# EAGLE design v1.0 SMT Practice Keychain (EAGLE 9.6.2)
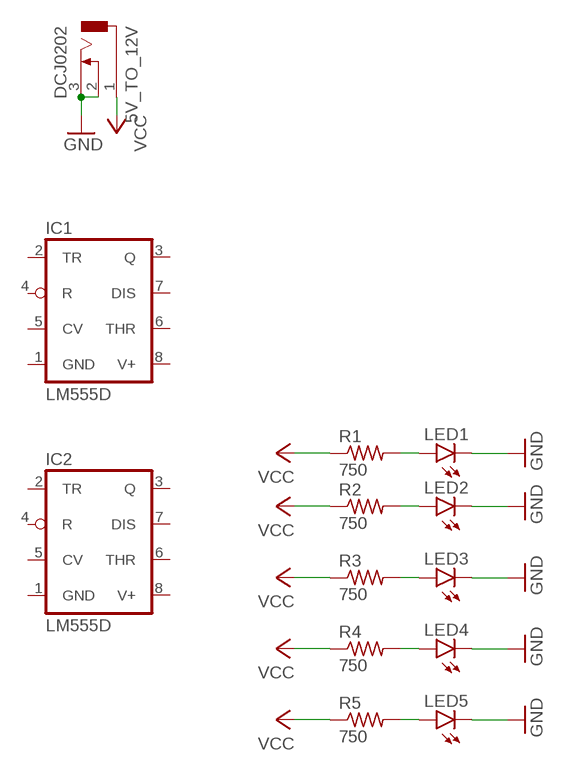
[diagram p0: schematic, sheet 1]

## Parts
5V_TO_12V  DCJ0202  [DCJ0202]
IC1  LM555D  [SO08]
IC2  LM555D  [SO08]
LED1  LEDCHIPLED_1206  [CHIPLED_1206]
LED2  LEDCHIPLED_1206  [CHIPLED_1206]
LED3  LEDCHIPLED_1206  [CHIPLED_1206]
LED4  LEDCHIPLED_1206  [CHIPLED_1206]
LED5  LEDCHIPLED_1206  [CHIPLED_1206]
R1  750  R-US_R1206  [R1206]
R2  750  R-US_R1206  [R1206]
R3  750  R-US_R1206  [R1206]
R4  750  R-US_R1206  [R1206]
R5  750  R-US_R1206  [R1206]

## Nets
GND: 5V_TO_12V.2 5V_TO_12V.3 LED1.C LED2.C LED3.C LED4.C LED5.C
N$1: LED1.A R1.2
N$2: LED2.A R2.2
N$3: LED3.A R3.2
N$4: LED4.A R4.2
N$5: LED5.A R5.2
VCC: 5V_TO_12V.1 R1.1 R2.1 R3.1 R4.1 R5.1
Unconnected: IC1.2(TR) IC1.3(Q) IC1.4(R) IC1.5(CV) IC1.6(THR) IC1.7(DIS) IC2.2(TR) IC2.3(Q) IC2.4(R) IC2.5(CV) IC2.6(THR) IC2.7(DIS)

## Power pins joined to a net without a drawn wire
GND: IC1.1(GND) IC2.1(GND)
V+: IC1.8(V+) IC2.8(V+)

## Library data of the parts
5V_TO_12V = con-jack:DCJ0202: DC POWER JACK Source: DCJ0202.pdf; OC_FARNELL: unknown; OC_NEWARK: unknown
IC1 IC2 = adafruit:*555: TIMER Changed DIP package to have round (not oval) pin pads http://www.ladyada.net/library/pcb/eaglelibrary.html
LED1-LED5 = led:LED: LED OSRAM: - CHIPLED LG R971, LG N971, LY N971, LG Q971, LY Q971, LO R971, LY R971 LH N974, LH R974 LS Q976, LO Q976, LY Q976 LO Q996 - Hyper CHIPLED LW Q18S LB Q993, LB Q99A, LB R99A - SideLED LS A670, LO A670, LY A670, LG A670, LP A670 LB A673, LV A673, LT A673, LW A673 LH A674 LY A675 LS A676, LA A676, LO A676, LY A676, LW A676 LS A679, LY A679, LG A679 - Hyper Micro SIDELED® LS Y876, LA Y876, LO Y876, LY Y876 LT Y87S - SmartLED LW L88C, LW L88S LB L89C, LB L89S, LG L890 LS L89K, LO L89K, LY L89K LS L896, LA L896, LO L896, LY L896 - TOPLED LS T670, LO T670, LY T670, LG T670, LP T670 LSG T670, LSP T670, LSY T670, LOP T670, LYG T670 LG T671, LOG T671, LSG T671 LB T673, LV T673, LT T673, LW T673 LH T674 LS T676, LA T676, LO T676, LY T676, LB T676, LH T676, LSB T676, LW T676 LB T67C, LV T67C, LT T67C, LS T67K, LO T67K, LY T67K, LW E67C LS E67B, LA E67B, LO E67B, LY E67B, LB E67C, LV E67C, LT E67C LW T67C LS T679, LY T679, LG T679 LS T770, LO T770, LY T770, LG T770, LP T770 LB T773, LV T773, LT T773, LW T773 LH T774 LS E675, LA E675, LY E675, LS T675 LS T776, LA T776, LO T776, LY T776, LB T776 LHGB T686 LT T68C, LB T68C - Hyper Mini TOPLED® LB M676 - Mini TOPLED Santana® LG M470 LS M47K, LO M47K, LY M47K Source: http://www.osram.convergy.de LUXEON: - LUMILED® LXK2-PW12-R00, LXK2-PW12-S00, LXK2-PW14-U00, LXK2-PW14-V00 LXK2-PM12-R00, LXK2-PM12-S00, LXK2-PM14-U00 LXK2-PE12-Q00, LXK2-PE12-R00, LXK2-PE12-S00, LXK2-PE14-T00, LXK2-PE14-U00 LXK2-PB12-K00, LXK2-PB12-L00, LXK2-PB12-M00, LXK2-PB14-N00, LXK2-PB14-P00, LXK2-PB14-Q00 LXK2-PR12-L00, LXK2-PR12-M00, LXK2-PR14-Q00, LXK2-PR14-R00 LXK2-PD12-Q00, LXK2-PD12-R00, LXK2-PD12-S00 LXK2-PH12-R00, LXK2-PH12-S00 LXK2-PL12-P00, LXK2-PL12-Q00, LXK2-PL12-R00 Source: www.luxeon.com KINGBRIGHT: KA-3528ASYC Source: www.kingbright.com
R1-R5 = adafruit:R-US_: RESISTOR, American symbol

## Board
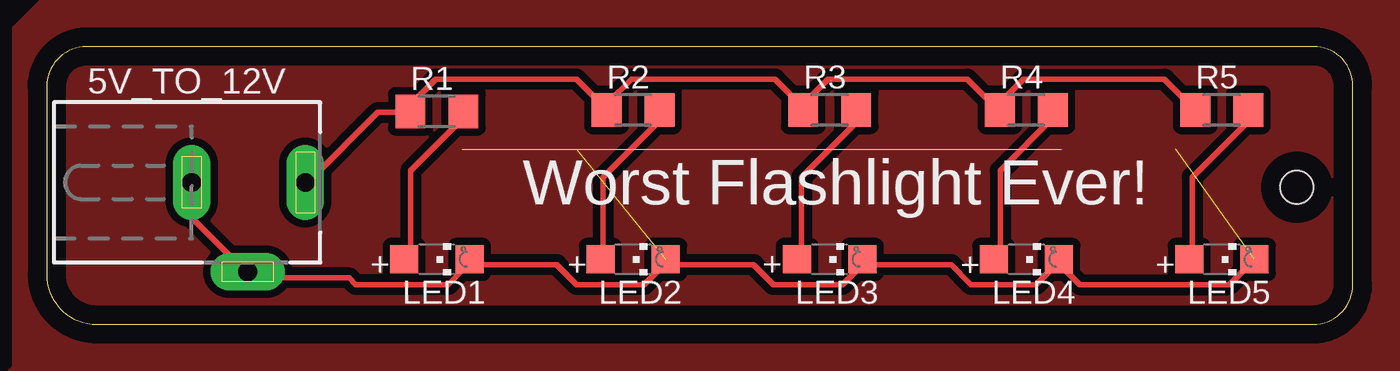
[diagram p1: board, top side]
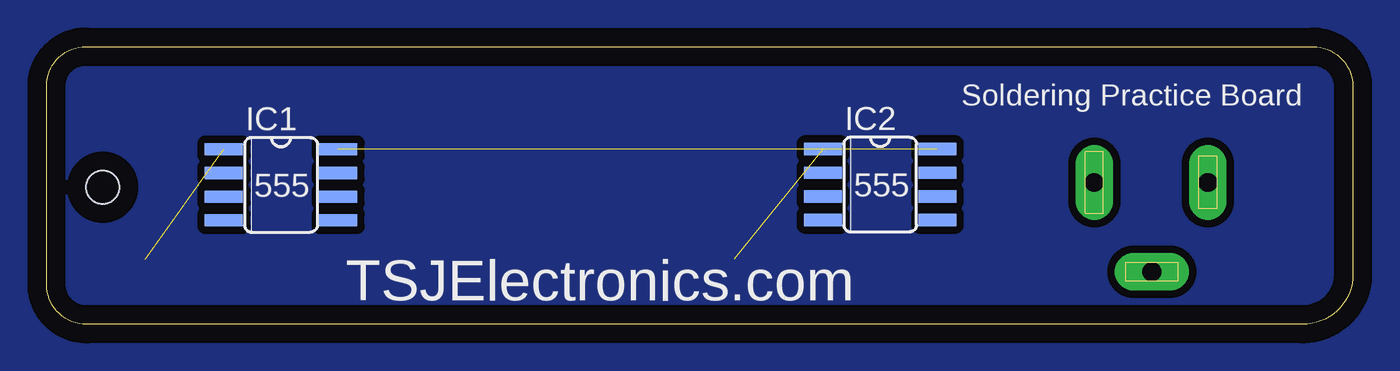
[diagram p2: board, bottom side, seen from below]

Size 70.15 x 14.91 mm. Coordinates in mm from the lower left corner, seen from the top.
Outline: 70.15,2.13 70.15,12.8 arc90 68.03,14.91 2.15,14.91 arc90 0,12.76 0,2.69 arc90 2.69,0 68.01,0 arc90 70.15,2.13
Copper layers (1*16): Top 0.035mm / dielectric 1.5mm / Bottom 0.035mm
Design rules "default *": minimum track width 12mil, minimum drill 0.35mm, track to track 16mil, track to pad 16mil, pad to pad 16mil, via to via 16mil, smd to smd 16mil, copper to edge 40mil, drill to drill 6mil, minimum pad ring 10mil, minimum via ring 8mil, stop-mask expansion 4mil, vias tented up to drill 0mil, thermal gap 10mil
Holes 1.78 mm at 67.14,7.36

### Footprints (pad centres in the part's own frame; a part is rotated, then mirrored left to right if it is on the bottom)
DCJ0202 = drill 1 pad 2 long: 1 0,3.1; 2 4.8,0; 3 0,-3
SO08 = smd 0.66 x 2.032: 1 -1.905,-3.073; 2 -0.635,-3.073; 3 0.635,-3.073; 4 1.905,-3.073; 5 1.905,3.073; 6 0.635,3.073; 7 -0.635,3.073; 8 -1.905,3.073
CHIPLED_1206 = smd 1.5 x 1.5: A 0,-1.75; C 0,1.75
R1206 = smd 1.6 x 1.803: 1 -1.422,0; 2 1.422,0

### Placement (x,y rotation side)
5V_TO_12V  10.79,7.62 270 top
IC1  57.56,7.49 270 bottom
IC2  25.39,7.5 270 bottom
LED1  20.95,3.49 270 top
LED2  31.49,3.49 270 top
LED3  42.05,3.49 270 top
LED4  52.61,3.49 270 top
LED5  63.1,3.49 270 top
R1  20.95,11.43 0 top
R2  31.49,11.51 0 top
R3  42.06,11.51 0 top
R4  52.61,11.51 0 top
R5  63.1,11.51 0 top

### Tracks (layer width: path | path; a pad name or v marks a point on that pad's centre or on a via)
BB
  pour Top: -1.8,15.93 -1.8,-2.27 -2.11,-2.58 73.89,-2.58 74.75,-1.72 72.79,0.23 72.79,19.76 2.03,19.76
BBB
  pour Bottom: -3.36,20.23 -3.36,-5.47 -2.66,-6.17 76.93,-6.17 79.28,-3.83 79.28,19.99 76.62,22.65 -0.94,22.65
GND  (2 unrouted)
  Top 0.305: 5V_TO_12V.3 7.82,7.47 7.82,5.69 10.67,2.85 5V_TO_12V.2 11.02,2.49 16.25,2.49 16.6,2.13 21.56,2.13 22.4,2.97 22.4,3.2 LED1.C 22.76,3.2 27.39,3.2 28.46,2.13 32.09,2.13 32.96,3 LED2.C 33.43,3.2 37.96,3.2 39.03,2.13 42.73,2.13 43.72,3.13 LED3.C 44.09,3.2 48.58,3.2 49.65,2.13 53.13,2.13 54.36,3.37 LED4.C 54.41,3.2 55.47,2.13 63.51,2.13 64.58,3.2 64.36,3.2 LED5.C 64.72,3.2
N$1
  Top 0.305: R1.2 22.38,11.07 19.56,8.26 19.56,3.56 LED1.A
N$2
  Top 0.305: R2.2 32.91,10.94 29.87,7.9 29.87,3.56 LED2.A
N$3
  Top 0.305: LED3.A 40.54,3.56 40.54,7.9 43.48,10.84 R3.2
N$4
  Top 0.305: R4.2 54.03,11.08 51.21,8.26 51.21,3.56 LED4.A
N$5
  Top 0.305: R5.2 64.53,10.91 61.52,7.9 61.52,3.56 LED5.A
V+  (1 unrouted)
VCC
  Top 0.305: 5V_TO_12V.1 14.22,7.82 17.78,11.38 19.2,11.38 R1.1 19.57,11.85 20.88,13.16 28.45,13.16 29.87,11.73 R2.1 30.07,11.78 30.16,11.91 31.41,13.16 39.12,13.16 40.54,11.73 R3.1 40.63,11.83 41.96,13.16 49.44,13.16 50.89,11.71 R4.1 51.22,11.91 52.46,13.16 60.03,13.16 61.45,11.73 61.52,11.73 R5.1

### Text on the board
tPlace: Worst Flashlight Ever! | + | + | + | + | +
bPlace: Soldering Practice Board | 555 | 555 | TSJElectronics.com